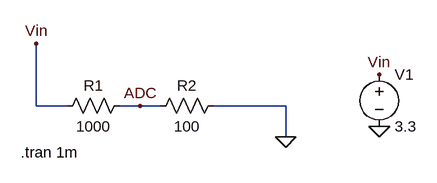
[diagram p0: schematic Pomiar_R.asc]
Pomiar_R.asc, the LTspice schematic file:
Version 4.1
SHEET 1 880 680
WIRE 0 144 0 48
WIRE 48 144 0 144
WIRE 160 144 128 144
WIRE 192 144 160 144
WIRE 384 144 272 144
WIRE 384 192 384 144
FLAG 384 192 0
FLAG 528 176 0
FLAG 528 96 Vin
FLAG 0 48 Vin
FLAG 160 144 ADC
SYMBOL res 144 128 R90
WINDOW 0 0 56 VBottom 2
WINDOW 3 32 56 VTop 2
SYMATTR InstName R1
SYMATTR Value 1000
SYMATTR SpiceLine tol=0.1 pwr=0.25
SYMBOL res 288 128 R90
WINDOW 0 0 56 VBottom 2
WINDOW 3 32 56 VTop 2
SYMATTR InstName R2
SYMATTR Value 100
SYMBOL voltage 528 80 R0
WINDOW 123 0 0 Left 0
WINDOW 39 0 0 Left 0
SYMATTR InstName V1
SYMATTR Value 3.3
TEXT -24 216 Left 2 !.tran 1m

The netlist it stands for:
* Pomiar_R.asc
R1 ADC Vin 1000 tol=0.1 pwr=0.25
R2 0 ADC 100
V1 Vin 0 3.3
.tran 1m
.backanno
.end